# Altium schematic sheet SmartWatch-V2.SchDoc
size A3; DocumentNumber: 1; SheetNumber: 1; SheetTotal: 3
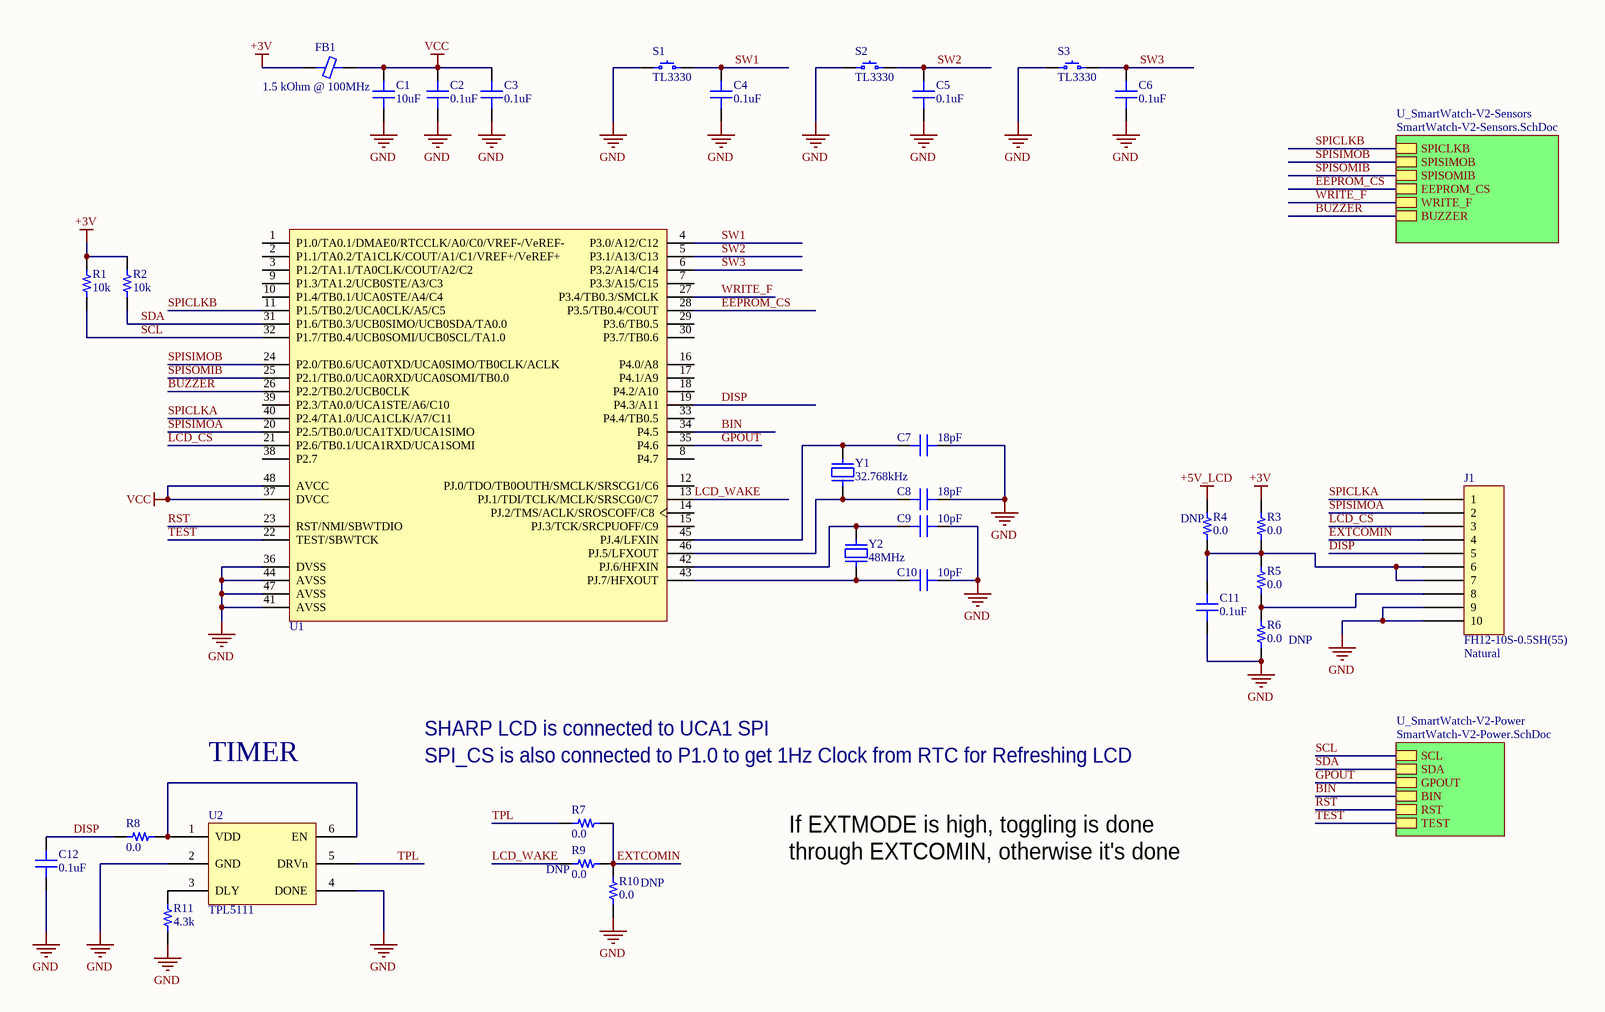
[diagram p0: SmartWatch-V2.SchDoc]

## Parts
C1  10uF  [CAP 0603/1608]
C2  0.1uF  [CAP 0402/1005]
C3  0.1uF  [CAP 0402/1005]
C4  0.1uF  [CAP 0402/1005]
C5  0.1uF  [CAP 0402/1005]
C6  0.1uF  [CAP 0402/1005]
C7  18pF  [CAP 0402/1005]
C8  18pF  [CAP 0402/1005]
C9  10pF  [CAP 0402/1005]
C10  10pF  [CAP 0402/1005]
C11  0.1uF  [CAP 0402/1005]
C12  0.1uF  [CAP 0402/1005]
FB1  1.5 kOhm @ 100MHz  [FER 0603/1608]
J1  FH12-10S-0.5SH(55)  Colour: Natural  [FH12-10S-0.5SH(55)]
R1  10k  [RES 0402/1005]
R2  10k  [RES 0402/1005]
R3  0.0  [RES 0603/1608]
R4  0.0  [RES 0603/1608]
R5  0.0  [RES 0603/1608]
R6  0.0  [RES 0603/1608]
R7  0.0  [RES 0603/1608]
R8  0.0  [RES 0603/1608]
R9  0.0  [RES 0603/1608]
R10  0.0  [RES 0603/1608]
R11  4.3k  [RES 0603/1608]
S1  TL3330  [TL3330]
S2  TL3330  [TL3330]
S3  TL3330  [TL3330]
U1  MSP430FR5969IRGZ  [TI-RGZ48-4100X4100TP_N]  (value not drawn)
U2  TPL5111  [TI SOT-23-6 DDC]
Y1  32.768kHz  [ABRACON ABS07]
Y2  48MHz  [Kyocera CX3225GB]

## Sub-sheets
U_SmartWatch-V2-Power = SmartWatch-V2-Power.SchDoc: SCL, SDA, GPOUT, BIN, RST, TEST
U_SmartWatch-V2-Sensors = SmartWatch-V2-Sensors.SchDoc: SPICLKB, SPISIMOB, SPISOMIB, EEPROM_CS, WRITE_F, BUZZER

## Nets
+3V: FB1.1 R1.2 R2.2 R3.2
+5V_LCD: R4.2
GND: C1.1 C2.1 C3.1 C4.1 C5.1 C6.1 C7.2 C8.2 C9.2 C10.2 C11.1 C12.1 J1.9 J1.10 R6.1 R10.1 R11.1 S1.1 S2.1 S3.1 U1.36(DVSS) U1.41(AVSS) U1.44(AVSS) U1.47(AVSS) U2.2(GND) U2.4(DONE)
VCC: C1.2 C2.2 C3.2 FB1.2 U1.37(DVCC) U1.48(AVCC)
BIN: U1.34(P4.5) ; sheet U_SmartWatch-V2-Power/BIN
BUZZER: U1.26(P2.2/TB0.2/UCB0CLK) ; sheet U_SmartWatch-V2-Sensors/BUZZER
DISP: C12.2 J1.5 R8.2 U1.19(P4.3/A11)
EEPROM_CS: U1.28(P3.5/TB0.4/COUT) ; sheet U_SmartWatch-V2-Sensors/EEPROM_CS
EXTCOMIN: J1.4 R7.1 R9.1 R10.2
GPOUT: U1.35(P4.6) ; sheet U_SmartWatch-V2-Power/GPOUT
LCD_CS: J1.3 U1.21(P2.6/TB0.1/UCA1RXD/UCA1SOMI)
LCD_WAKE: R9.2 U1.13(PJ.1/TDI/TCLK/MCLK/SRSCG0/C7)
RST: U1.23(RST/NMI/SBWTDIO) ; sheet U_SmartWatch-V2-Power/RST
SCL: R1.1 U1.32(P1.7/TB0.4/UCB0SOMI/UCB0SCL/TA1.0) ; sheet U_SmartWatch-V2-Power/SCL
SDA: R2.1 U1.31(P1.6/TB0.3/UCB0SIMO/UCB0SDA/TA0.0) ; sheet U_SmartWatch-V2-Power/SDA
SPICLKA: J1.1 U1.40(P2.4/TA1.0/UCA1CLK/A7/C11)
SPICLKB: U1.11(P1.5/TB0.2/UCA0CLK/A5/C5) ; sheet U_SmartWatch-V2-Sensors/SPICLKB
SPISIMOA: J1.2 U1.20(P2.5/TB0.0/UCA1TXD/UCA1SIMO)
SPISIMOB: U1.24(P2.0/TB0.6/UCA0TXD/UCA0SIMO/TB0CLK/ACLK) ; sheet U_SmartWatch-V2-Sensors/SPISIMOB
SPISOMIB: U1.25(P2.1/TB0.0/UCA0RXD/UCA0SOMI/TB0.0) ; sheet U_SmartWatch-V2-Sensors/SPISOMIB
SW1: C4.2 S1.2 U1.4(P3.0/A12/C12)
SW2: C5.2 S2.2 U1.5(P3.1/A13/C13)
SW3: C6.2 S3.2 U1.6(P3.2/A14/C14)
TEST: U1.22(TEST/SBWTCK) ; sheet U_SmartWatch-V2-Power/TEST
TPL: R7.2 U2.5(DRVn)
WRITE_F: U1.27(P3.4/TB0.3/SMCLK) ; sheet U_SmartWatch-V2-Sensors/WRITE_F
NetC7_1: C7.1 U1.45(PJ.4/LFXIN) Y1.2
NetC8_1: C8.1 U1.46(PJ.5/LFXOUT) Y1.1
NetC9_1: C9.1 U1.42(PJ.6/HFXIN) Y2.3
NetC10_1: C10.1 U1.43(PJ.7/HFXOUT) Y2.1
NetC11_2: C11.2 J1.6 J1.7 R3.1 R4.1 R5.2
NetJ1_8: J1.8 R5.1 R6.2
NetR8_1: R8.1 U2.1(VDD) U2.6(EN)
NetR11_2: R11.2 U2.3(DLY)

Not connected (* = marked no-connect by the designer): U1 1(P1.0/TA0.1/DMAE0/RTCCLK/A0/C0/VREF-/VeREF-) 2(P1.1/TA0.2/TA1CLK/COUT/A1/C1/VREF+/VeREF+) 3(P1.2/TA1.1/TA0CLK/COUT/A2/C2) 7(P3.3/A15/C15) 8(P4.7) 9(P1.3/TA1.2/UCB0STE/A3/C3) 10(P1.4/TB0.1/UCA0STE/A4/C4) 12(PJ.0/TDO/TB0OUTH/SMCLK/SRSCG1/C6) 14(PJ.2/TMS/ACLK/SROSCOFF/C8) 15(PJ.3/TCK/SRCPUOFF/C9) 16(P4.0/A8) 17(P4.1/A9) 18(P4.2/A10) 29(P3.6/TB0.5) 30(P3.7/TB0.6) 33(P4.4/TB0.5) 38(P2.7) 39(P2.3/TA0.0/UCA1STE/A6/C10)

## Notes on the sheet
- (near R4) DNP
- (near R6) DNP
- TIMER
- SHARP LCD is connected to UCA1 SPI
- SPI_CS is also connected to P1.0 to get 1Hz Clock from RTC for Refreshing LCD
- If EXTMODE is high, toggling is done through EXTCOMIN, otherwise it's done through SPI.
- (near R9) DNP
- DNP

## Library data of the parts
C1 = GRM188R60J106ME47D: CAP CER 10UF 6.3V X5R 0603; Manufacturer: Murata Electronics North America; TemperatureRange: -55C ~ 85C; Tolerance: 20%; Value: 10uF; Part Number: GRM188R60J106ME47D; PartId: 12950; Supplier 1: Digi-Key; Supplier Part Number 1: 490-3896-2-ND; ComponentLink1Description: Datasheet; ComponentLink1URL: http://www.murata.com/~/media/webrenewal/support/library/catalog/products/capacitor/mlcc/c02e.pdf; ComponentLink2Description: Digi-Key Listing; ComponentLink2URL: https://www.digikey.com/product-detail/en/murata-electronics-north-america/GRM188R60J106ME47D/490-3896-2-ND/965910; TemperatureCoefficient: X5R; Voltage: 6.3V; Price: 0,031; Device Package: 0603 (1608 Metric)
C2-C6 C11 C12 = C1005X7R1C104K050BC: CAP CER 0.1UF 16V X7R 0402; Manufacturer: TDK Corporation; TemperatureRange: -55C ~ 125C; Tolerance: 10%; Value: 0.1uF; Part Number: C1005X7R1C104K050BC; PartId: 3856; Supplier 1: Digi-Key; Supplier Part Number 1: 445-4952-2-ND; ComponentLink1Description: Datasheet; ComponentLink1URL: https://product.tdk.com/info/en/catalog/datasheets/mlcc_commercial_general_en.pdf; ComponentLink2Description: Digi-Key listing; ComponentLink2URL: http://digikey.com/product-detail/en/C1005X7R1C104K050BC/445-4952-2-ND/2093220; TemperatureCoefficient: X7R; Voltage: 16V; Price: 0,0066; Type: -; Device Package: 0402 (1005 Metric)
C7 C8 = C1005C0G1H180J050BA: CAP CER 18PF 50V C0G 0402; Manufacturer: TDK Corporation; TemperatureRange: -55C ~ 125C; TemperatureCoefficient: C0G, NP0; Tolerance: 5%; Value: 18pF; Part Number: C1005C0G1H180J050BA; PartId: 3882; Supplier 1: Digi-Key; Supplier Part Number 1: 445-1238-2-ND; ComponentLink1Description: Datasheet; ComponentLink1URL: https://product.tdk.com/info/en/catalog/datasheets/mlcc_commercial_general_en.pdf; ComponentLink2Description: Digi-Key listing; ComponentLink2URL: http://digikey.com/product-detail/en/C1005C0G1H180J050BA/445-1238-2-ND/513675; Voltage: 50V; Price: 0,006; Type: -; Device Package: 0402 (1005 Metric)
C9 C10 = C1005C0G1H100D050BA: CAP CER 10PF 50V C0G 0402; Manufacturer: TDK Corporation; TemperatureRange: -55C ~ 125C; TemperatureCoefficient: C0G, NP0; Tolerance: 0.5pF; Value: 10pF; Part Number: C1005C0G1H100D050BA; PartId: 3878; Supplier 1: Digi-Key; Supplier Part Number 1: 445-1235-2-ND; ComponentLink1Description: Datasheet; ComponentLink1URL: https://product.tdk.com/info/en/catalog/datasheets/mlcc_commercial_general_en.pdf; ComponentLink2Description: Digi-Key listing; ComponentLink2URL: http://digikey.com/product-detail/en/C1005C0G1H100D050BA/445-1235-2-ND/513663; Voltage: 50V; Price: 0,006; Type: -; Device Package: 0402 (1005 Metric)
FB1 = BLM18HE152SN1D: FERRITE CHIP 1500 OHM 500MA 0603; Manufacturer: Murata Electronics North America; Type: Differential Mode - Single; DC Resistance: 500 mOhm Max; Part Number: BLM18HE152SN1D; PartId: 6736; Value: 1.5 kOhm @ 100MHz; Supplier 1: Digi-Key; Supplier Part Number 1: 490-5216-2-ND; ComponentLink1Description: Datasheet; ComponentLink1URL: http://search.murata.co.jp/Ceramy/image/img/PDF/ENG/L0110S0101BLM18H.pdf; ComponentLink2Description: Digi-Key listing; ComponentLink2URL: http://digikey.com/product-detail/en/BLM18HE152SN1D/490-5216-2-ND/1948321; Price: 0,0833; Device Package: 0603 (1608 Metric); Current Rating: 500mA
J1 = FH12-10S-0.5SH(55): CONN FFC BOTTOM 10POS 0.50MM R/A; Part Number: FH12-10S-0.5SH(55); PartId: 16458
R1 R2 = ERA-2AED103X: RES SMD 10K OHM 0.5% 1/16W 0402; Manufacturer: Panasonic Electronic Components; TemperatureRange: -55C ~ 155C; TemperatureCoefficient: 25ppm/C; PowerRating: 0.063W, 1/16W; Value: 10k; Part Number: ERA-2AED103X; PartId: 540; Supplier 1: Digi-Key; Supplier Part Number 1: P10KDETR-ND; ComponentLink1Description: Datasheet; ComponentLink1URL: http://industrial.panasonic.com/lecs/www-data/pdf/AOA0000/AOA0000CE26.pdf; ComponentLink2Description: Digikey listing; ComponentLink2URL: http://digikey.com/product-detail/en/ERA-2AED103X/P10KDETR-ND/1706126; Tolerance: 0.5%; Price: 0,0353; Type: Thin Film; Device Package: 0402 (1005 Metric)
R3-R5 R7 R8 = ERJ-3GEY0R00V: RES SMD 0.0OHM JUMPER 1/10W 0603; Manufacturer: Panasonic Electronic Components; TemperatureRange: -55C ~ 155C; PowerRating: 0.1W, 1/10W; Value: 0.0; Part Number: ERJ-3GEY0R00V; PartId: 16111; Supplier 1: Digi-Key; Supplier Part Number 1: P0.0GTR-ND; ComponentLink1Description: Datasheet; ComponentLink1URL: http://industrial.panasonic.com/www-cgi/jvcr13pz.cgi?E+PZ+3+AOA0001+ERJ3GEY0R00V+7+WW; ComponentLink2Description: Digi-Key Listing; ComponentLink2URL: https://www.digikey.com/product-detail/en/panasonic-electronic-components/ERJ-3GEY0R00V/P0.0GTR-ND/135656; Tolerance: Jumper; Price: 0,0031; Device Package: 0603 (1608 Metric)
R6 R9 R10 = ERJ-3GEY0R00V: DNP; Manufacturer: Panasonic Electronic Components; TemperatureRange: -55C ~ 155C; Tolerance: Jumper; PowerRating: 0.1W, 1/10W; Value: 0.0; Part Number: ERJ-3GEY0R00V; PartId: 16111; Supplier 1: Digi-Key; Supplier Part Number 1: P0.0GTR-ND; ComponentLink1Description: Datasheet; ComponentLink1URL: http://industrial.panasonic.com/www-cgi/jvcr13pz.cgi?E+PZ+3+AOA0001+ERJ3GEY0R00V+7+WW; ComponentLink2Description: Digi-Key Listing; ComponentLink2URL: https://www.digikey.com/product-detail/en/panasonic-electronic-components/ERJ-3GEY0R00V/P0.0GTR-ND/135656; Price: 0,0031; Device Package: 0603 (1608 Metric)
R11 = ERA-3AEB432V: RES SMD 4.3K OHM 0.1% 1/10W 0603; Manufacturer: Panasonic Electronic Components; TemperatureRange: -55C ~ 155C; TemperatureCoefficient: 25ppm/C; PowerRating: 0.1W, 1/10W; Value: 4.3k; Part Number: ERA-3AEB432V; PartId: 1536; Supplier 1: Digi-Key; Supplier Part Number 1: P4.3KDBTR-ND; ComponentLink1Description: Datasheet; ComponentLink1URL: http://industrial.panasonic.com/lecs/www-data/pdf/AOA0000/AOA0000CE26.pdf; ComponentLink2Description: Digi-Key listing; ComponentLink2URL: http://digikey.com/product-detail/en/ERA-3AEB432V/P4.3KDBTR-ND/1465869; Tolerance: 0.1%; Price: 0,055; Type: Thin Film; Device Package: 0603 (1608 Metric)
S1-S3 = TL3330: SWITCH TACTILE SPST-NO 0.02A 15V; Manufacturer: E-Switch; Part Number: TL3330; PartId: 16469
U1 = MSP430FR5969IRGZ: 16BIT 64KB FRAM 48VQFN; Manufacturer: Texas Instruments; PartNumber: MSP430FR5969RGZ; ADC: 10-bit SAR; ADC Channels: 14; Brown Out Reset: Yes; DMA: 3; Eco-Plan: Green (RoHS & no Sb/Br); FRAM(KB): 16; GPIO: 33; Multiplier: 32x32; SRAM(B): 1024; SubFamily: FRAM Series; Timers - 16-bit: 5; USCI_A (UART/LIN/IrDA/SPI): 2; USCI_B (I2C & SPI): 1; DatasheetVersion: SLAS639D; PackageReference: RHA40-2900X2900TP; PackageDescription: 48-Pin Plastic Flat Pack, Body 7 x 7 mm, Pitch 0.5 mm; Supplier 1: Digi-Key; Supplier Part Number 1: 296-29235-2-ND; Supplier 2: Digi-Key; Supplier Part Number 2: 296-29235-1-ND; Supplier 3: Digi-Key; Supplier Part Number 3: 296-29235-6-ND; Supplier 4: Newark; Supplier Part Number 4: 45T9762; Supplier 5: Mouser; Supplier Part Number 5: 595-MSP430FR5739IDAR; Comparators: Yes; Frequency(MHz): 16; Real-Time Clock: Yes; SVS: Yes; Watchdog: Yes; Mounting Technology: Surface Mount; Code_JEDEC: MO-153; ComponentLink1Description: Manufacturer URL; ComponentLink1URL: http://www.ti.com/; ComponentLink2Description: Datasheet; ComponentLink2URL: http://www.ti.com/general/docs/lit/getliterature.tsp?genericPartNumber=MSP430FR5739&fileType=pdf; ComponentLink3Description: Package Specification; ComponentLink3URL: http://www.ti.com/litv/pdf/mtss003d; Part Number: MSP430FR5969IRGZ; PartId: 1
Y1 = ABS07-120-32.768KHZ-T: CRYSTAL 32.7680KHZ 6PF SMD; Manufacturer: Abracon LLC; Frequency Tolerance: 20ppm; ESR: 55 kOhm; Operating Mode: Fundamental; Part Number: ABS07-120-32.768KHZ-T; PartId: 8490; Supplier 1: Digi-Key; Supplier Part Number 1: 535-11937-2-ND; ComponentLink1Description: Datasheet; ComponentLink1URL: http://www.abracon.com/Resonators/ABS07-120-32.768kHz-T.pdf; ComponentLink2Description: Digi-Key Listing; ComponentLink2URL: http://www.digikey.com/product-detail/en/ABS07-120-32.768KHZ-T/535-11937-2-ND/3724043; Price: 0,3784; Type: kHz Crystal (Tuning Fork); Device Package: 2-SMD; Frequency: 32.768kHz; Frequency Stability: -; Load Capacitance: 6pF
Y2 = CX3225GB48000D0HPQCC: CRYSTAL 48.0000MHZ 8PF SMD; Manufacturer: AVX Corp/Kyocera Corp; Frequency Stability: 30ppm; Frequency Tolerance: 20ppm; ESR: 50 Ohm; Operating Mode: Fundamental; Part Number: CX3225GB48000D0HPQCC; PartId: 8842; Supplier 1: Digi-Key; Supplier Part Number 1: 1253-1226-2-ND; ComponentLink1Description: Datasheet; ComponentLink1URL: http://media.digikey.com/pdf/Data%20Sheets/AVX%20PDFs/CX3225GBxD0HPQCC_Series_Spec.pdf; ComponentLink2Description: Digi-Key Listing; ComponentLink2URL: https://www.digikey.com/product-detail/en/CX3225GB48000D0HPQCC/1253-1226-2-ND/4453903; Price: 0,3915; Type: MHz Crystal; Device Package: 4-SMD, No Lead (DFN, LCC); Series: CX3225GB, Kyocera; Frequency: 48MHz; Load Capacitance: 8pF